# EAGLE design main (EAGLE 4.15)
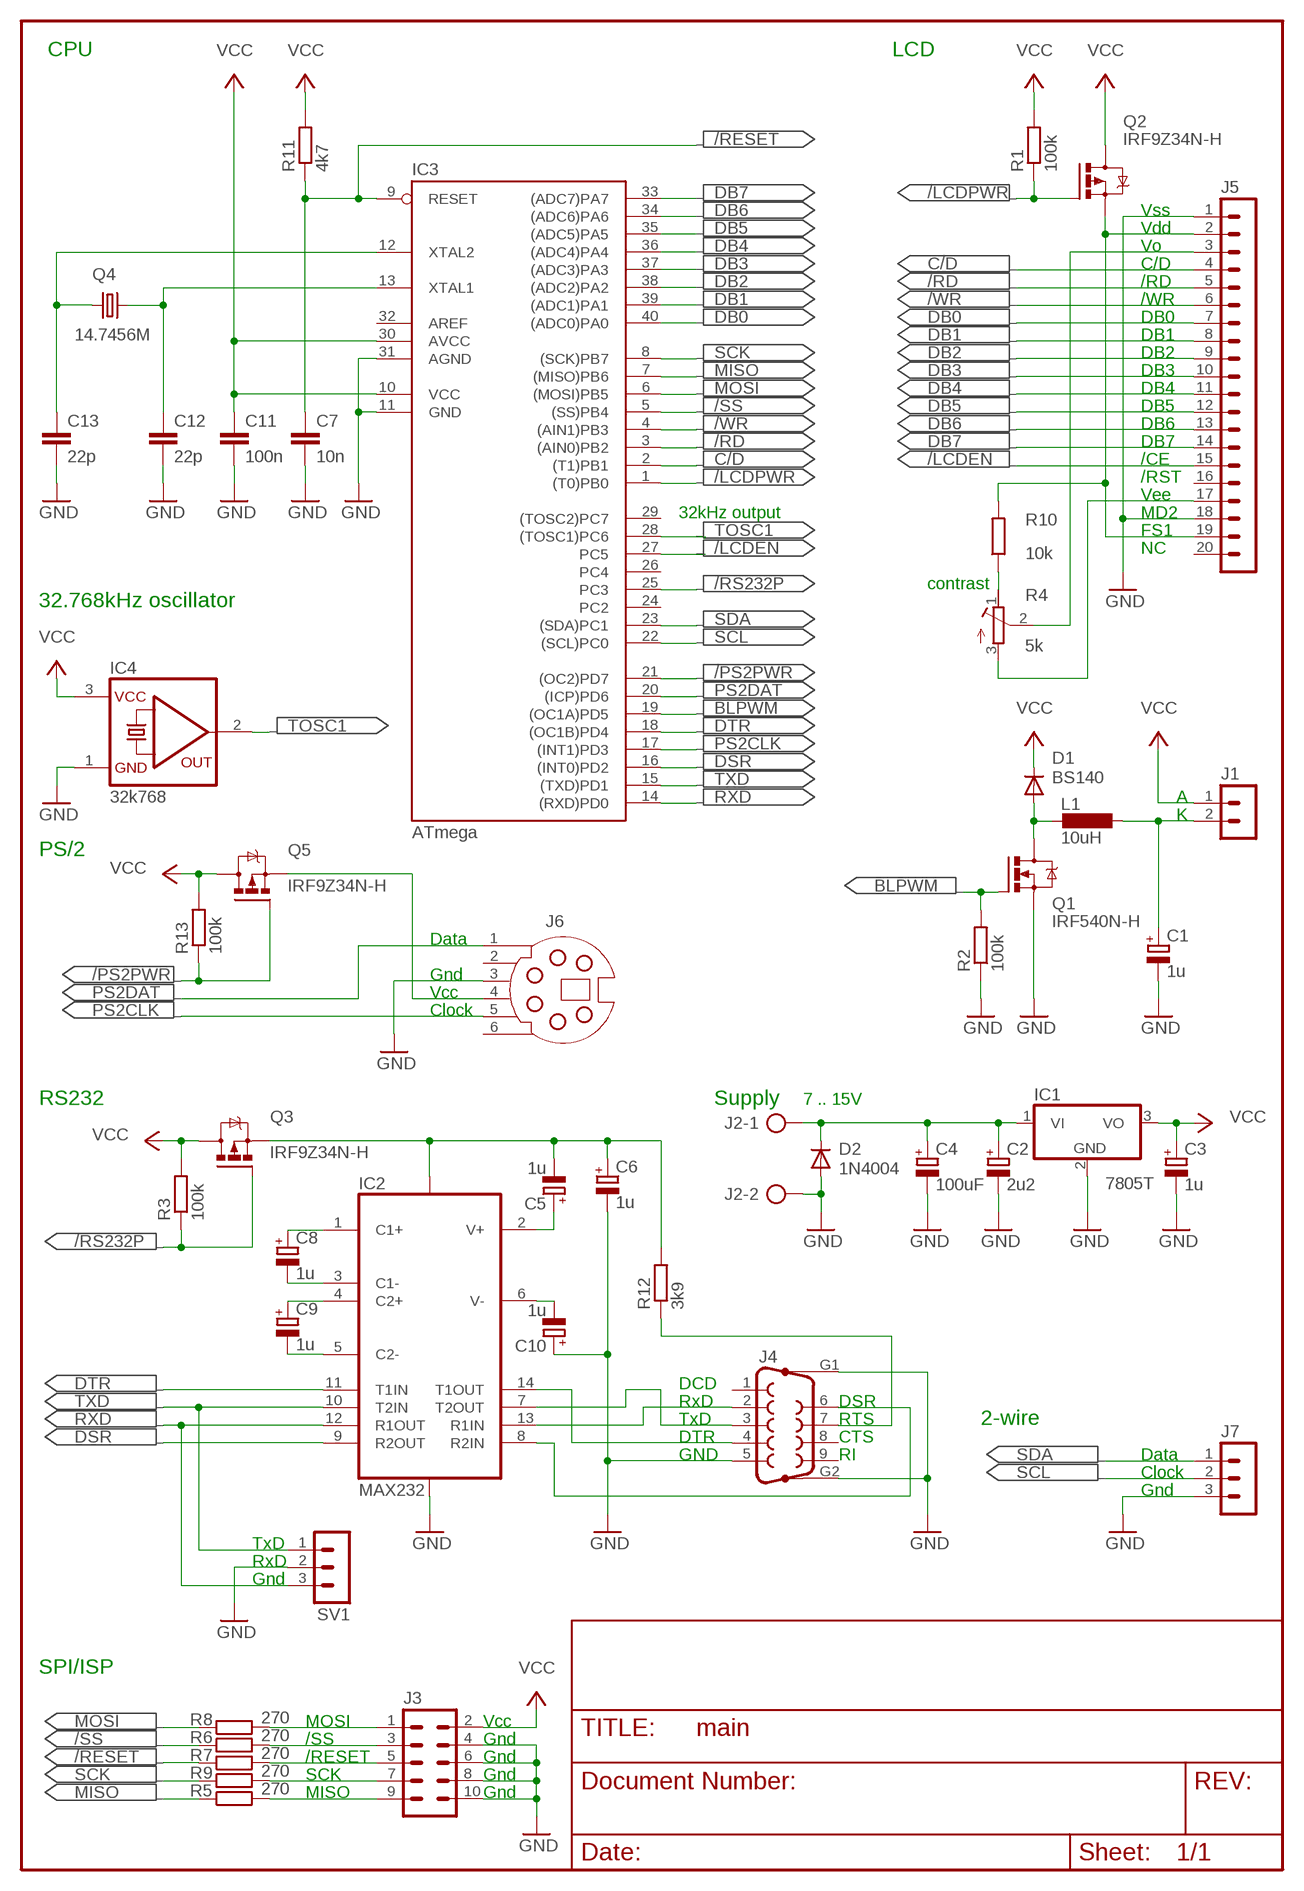
[diagram p0: schematic, sheet 1]

## Parts
C1  1u  CPOL-EUE2-5  [E2-5]
C2  2u2  CPOL-EUE2-5  [E2-5]
C3  1u  CPOL-EUE2-5  [E2-5]
C4  100uF  CPOL-EUE5-8.5  [E5-8,5]
C5  1u  CPOL-EUE2-5  [E2-5]
C6  1u  CPOL-EUE2-5  [E2-5]
C7  10n  C-EU050-025X075  [C050-025X075]
C8  1u  CPOL-EUE2-5  [E2-5]
C9  1u  CPOL-EUE2-5  [E2-5]
C10  1u  CPOL-EUE2-5  [E2-5]
C11  100n  C-EU050-025X075  [C050-025X075]
C12  22p  C-EU025-024X044  [C025-024X044]
C13  22p  C-EU025-024X044  [C025-024X044]
D1  BS140  1N4004  [DO41-10]
D2  1N4004  [DO41-10]
IC1  7805T  [TO220H]
IC2  MAX232  [DIL16]
IC3  ATmega  MEGA163P  [DIL40]
IC4  32k768  SG-10  [SIP3]
J1  MA02-1  [MA02-1]
J2  AK500/2  [AK500/2]
J3  ML10  [ML10]
J4  F09HP  [F09HP]
J5  MA20-1  [MA20-1]
J6  SSV-G06  [SSV-BC06]
J7  MA03-1  [MA03-1]
L1  10uH  L-EU0207/12  [0207/12]
Q1  IRF540N-H  [TO220AB-H]
Q2  IRF9Z34N-H  [TO220AB-H]
Q3  IRF9Z34N-H  [TO220AB-H]
Q4  14.7456M  CRYTALHC18U-H  [HC18U-H]
Q5  IRF9Z34N-H  [TO220AB-H]
R1  100k  R-EU_0207/12  [0207/12]
R2  100k  R-EU_0207/12  [0207/12]
R3  100k  R-EU_0207/12  [0207/12]
R4  5k  R-TRIMM43P  [RTRIM43P]
R5  270  R-EU_0207/12  [0207/12]
R6  270  R-EU_0207/12  [0207/12]
R7  270  R-EU_0207/12  [0207/12]
R8  270  R-EU_0207/12  [0207/12]
R9  270  R-EU_0207/12  [0207/12]
R10  10k  R-EU_0207/12  [0207/12]
R11  4k7  R-EU_0207/12  [0207/12]
R12  3k9  R-EU_0207/12  [0207/12]
R13  100k  R-EU_0207/12  [0207/12]
SV1  MA03-1  [MA03-1]

## Nets
/LCDEN: IC3.27(PC5) J5.15
/LCDPWR: IC3.1((T0)PB0) Q2.1(G) R1.1
/PS2PWR: IC3.21((OC2)PD7) Q5.1(G) R13.1
/RD: IC3.3((AIN0)PB2) J5.5
/RESET: C7.1 IC3.9(RESET) R7.1 R11.1
/RS232P: IC3.25(PC3) Q3.1(G) R3.1
/SS: IC3.5((SS)PB4) R6.1
/WR: IC3.4((AIN1)PB3) J5.6
BLPWM: IC3.19((OC1A)PD5) Q1.1(G) R2.2
C/D: IC3.2((T1)PB1) J5.4
DB0: IC3.40((ADC0)PA0) J5.7
DB1: IC3.39((ADC1)PA1) J5.8
DB2: IC3.38((ADC2)PA2) J5.9
DB3: IC3.37((ADC3)PA3) J5.10
DB4: IC3.36((ADC4)PA4) J5.11
DB5: IC3.35((ADC5)PA5) J5.12
DB6: IC3.34((ADC6)PA6) J5.13
DB7: IC3.33((ADC7)PA7) J5.14
DCD: C5.+ IC2.2(V+)
DSR: IC2.9(R2OUT) IC3.16((INT0)PD2)
DTR: IC2.11(T1IN) IC3.18((OC1B)PD4)
FS1: J5.2 J5.19 Q2.3(S) R10.2
GND: C1.- C2.- C3.- C4.- C6.- C7.2 C10.+ C11.2 C12.2 C13.2 D2.A IC1.2(GND) IC2.15(GND) IC3.11(GND) IC3.31(AGND) IC4.1(GND) J2.2 J3.4 J3.6 J3.8 J3.10 J4.5 J4.G1 J4.G2 J5.1 J5.18 J6.3 J7.3 Q1.3(S) R2.1 SV1.2
MISO: IC3.7((MISO)PB6) R5.1
MOSI: IC3.6((MOSI)PB5) R8.1
N$1: C13.1 IC3.12(XTAL2) Q4.1
N$2: IC2.13(R1IN) J4.2
N$3: IC2.7(T2OUT) J4.3
N$4: C12.1 IC3.13(XTAL1) Q4.2
N$5: J4.7 R12.1
N$6: IC2.14(T1OUT) J4.4
N$7: C8.- IC2.3(C1-)
N$8: C8.+ IC2.1(C1+)
N$9: J5.3 R4.2(S)
N$10: D1.A L1.1 Q1.2(D)
N$11: C9.- IC2.5(C2-)
N$12: C9.+ IC2.4(C2+)
N$13: C10.- IC2.6(V-)
N$14: R4.1(A) R10.1
N$15: C5.- C6.+ IC2.16(VCC) Q3.3(S) R12.2
N$16: C1.+ J1.2 L1.2
N$17: C2.+ C4.+ D2.C IC1.1(VI) J2.1
N$18: J6.4 Q5.3(S)
N$25: J3.9 R5.2
N$26: J3.7 R9.2
N$27: J3.5 R7.2
N$28: J3.1 R8.2
N$29: J3.3 R6.2
PS2CLK: IC3.17((INT1)PD3) J6.5
PS2DAT: IC3.20((ICP)PD6) J6.1
RXD: IC2.12(R1OUT) IC3.14((RXD)PD0) SV1.3
SCK: IC3.8((SCK)PB7) R9.1
SCL: IC3.22((SCL)PC0) J7.2
SDA: IC3.23((SDA)PC1) J7.1
T2OUT: IC2.8(R2IN) J4.6
TOSC1: IC3.28((TOSC1)PC6) IC4.2(OUT)
TXD: IC2.10(T2IN) IC3.15((TXD)PD1) SV1.1
VCC: C3.+ C11.1 D1.C IC1.3(VO) IC3.10(VCC) IC3.30(AVCC) IC4.3(VCC) J1.1 J3.2 Q2.2(D) Q3.2(D) Q5.2(D) R1.2 R3.2 R11.2 R13.2
VEE: J5.17 R4.3(E)
Unconnected: IC3.24(PC2) IC3.26(PC4) IC3.29((TOSC2)PC7) IC3.32(AREF) J4.1 J4.8 J4.9 J5.16 J5.20 J6.2 J6.6

## Notes on the sheet
- CPU | LCD
- Vss
- Vdd
- Vo
- C/D
- /RD
- /WR
- DB0
- DB1
- DB2
- DB3
- DB4
- DB5
- DB6
- DB7
- /CE
- /RST
- Vee
- 32kHz output | MD2
- FS1
- NC
- contrast
- 32.768kHz oscillator
- A
- K
- PS/2
- Data
- Gnd
- Vcc
- Clock
- RS232 | Supply | 7 .. 15V
- DCD
- RxD | DSR
- TxD | RTS | 2-wire
- DTR | CTS
- GND | RI | Data
- Clock
- Gnd
- TxD
- RxD
- Gnd
- SPI/ISP
- MOSI | Vcc
- /SS | Gnd
- /RESET | Gnd
- SCK | Gnd
- MISO | Gnd

## Library data of the parts
C1-C6 C8-C10 = tccn:CPOL-EU: POLARIZED CAPACITOR, European symbol
C7 C11-C13 = tccn:C-EU: CAPACITOR, European symbol
D1 D2 = tccn:1N4004: DIODE general purpose rectifier, 1 A
IC1 = tccn:78*: Positive VOLTAGE REGULATOR Source: http://cache.national.com/ds/LM/LM78L05.pdf http://www.fairchildsemi.com/ds/LM/LM7805.pdf
IC2 = tccn:MAX232: RS232 TRANSEIVER
IC3 = tccn:MEGA163*P: MICROCONTROLLER 16 Kbytes FLASH, 1 Kbytes EEPROM 1 Kbytes SRAM UART 8-channel 10 bit ADC hardware multiplier
IC4 = tccn:SG-10
J1 = tccn:MA02-1: PIN HEADER
J2 = tccn:AK500/2: CONNECTOR
J3 = tccn:ML10: HARTING
J4 = tccn:F09HP: SUB-D
J5 = tccn:MA20-1: PIN HEADER
J6 = tccn:SSV-G06: YAMAICHI CONNECTOR
J7 SV1 = tccn:MA03-1: PIN HEADER
L1 = tccn:L-EU: INDUCTOR, European symbol
Q1 = tccn:IRF540N: N-channel power MOSFET
Q2 Q3 Q5 = tccn:IRF9Z34N: P channel power MOSFET
Q4 = tccn:CRYTAL: CRYSTAL
R1-R3 R5-R13 = tccn:R-EU_: RESISTOR, European symbol
R4 = tccn:R-TRIMM: Trimm resistor

## Board
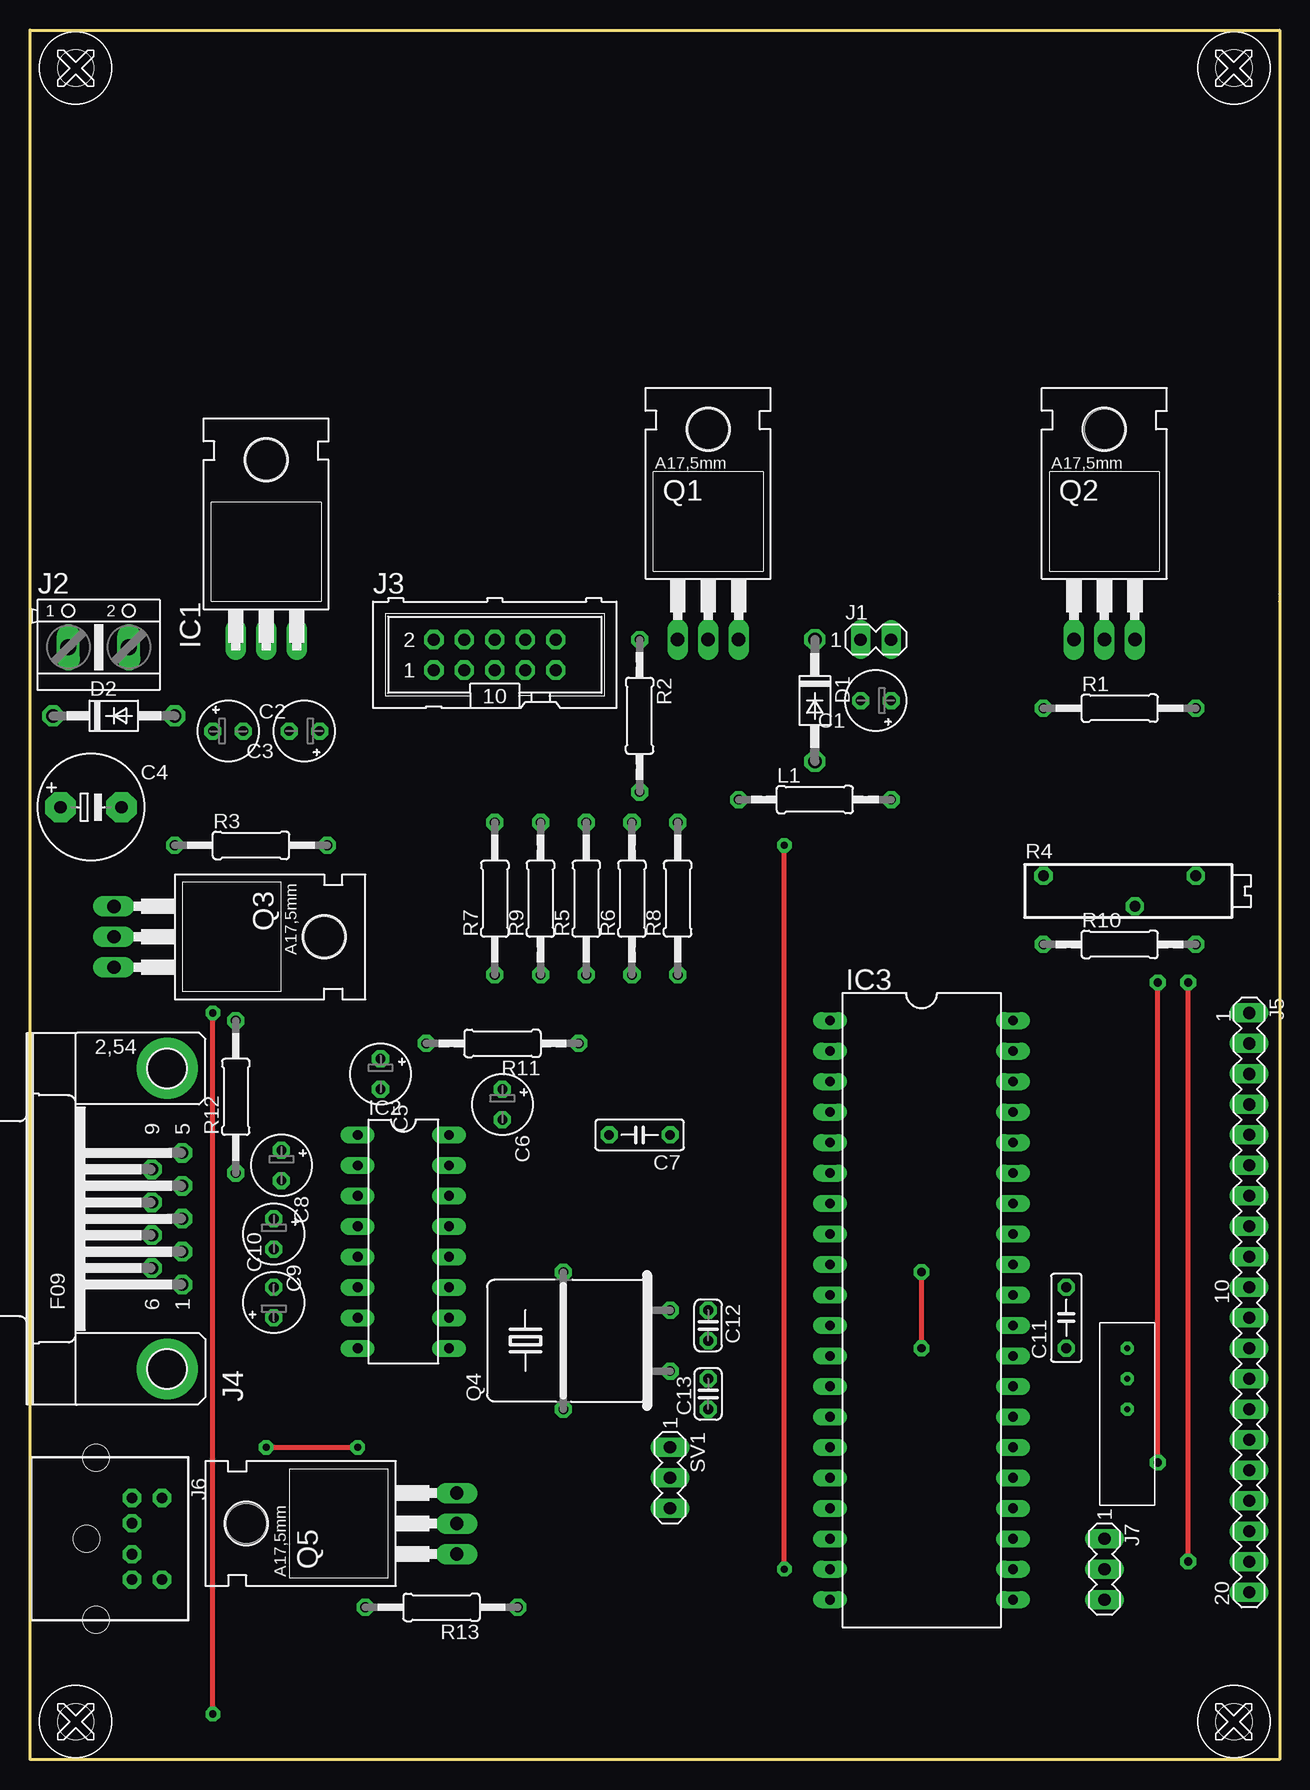
[diagram p1: board, top side]
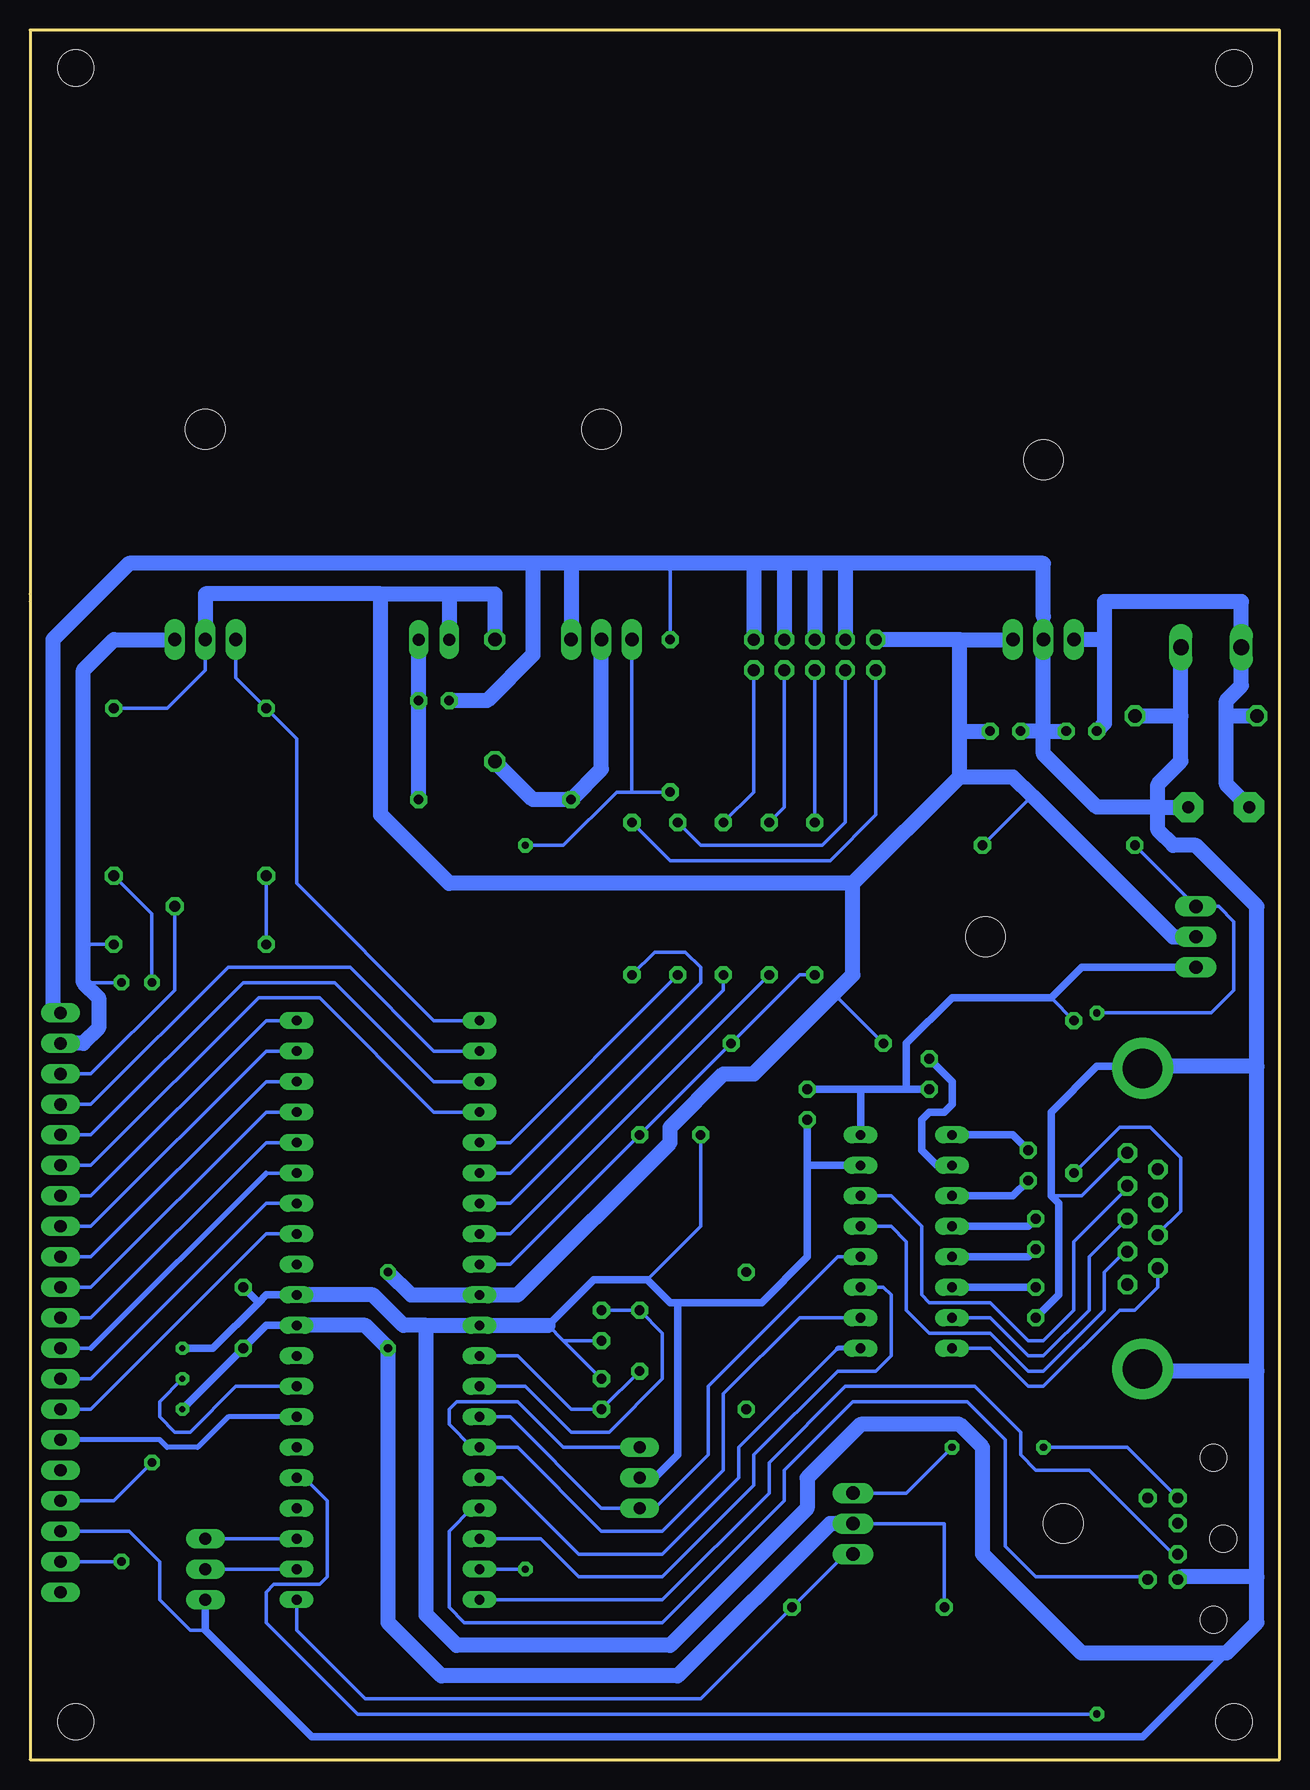
[diagram p2: board, bottom side, seen from below]

Size 104.14 x 144.14 mm. Coordinates in mm from the lower left corner, seen from the top.
Outline: 104.14,97.16 104.14,96.52
Outline: 104.14,96.52 104.14,0 0,0 0,144.14 104.14,144.14 104.14,96.52
Copper layers (1*16): Top 0.035mm / dielectric 1.5mm / Bottom 0.035mm
Design rules "drc": minimum track width 12mil, minimum drill 12mil, track to track 12mil, track to pad 12mil, pad to pad 12mil, via to via 12mil, smd to smd 12mil, copper to edge 25mil, drill to drill 25mil, minimum pad ring 12mil, minimum via ring 12mil, stop-mask expansion 4mil, vias tented up to drill 0mil, thermal gap 10mil

### Footprints (pad centres in the part's own frame; a part is rotated, then mirrored left to right if it is on the bottom)
E2-5 = drill 0.813 pad 1.27 octagon: + -1.27,0; - 1.27,0
E5-8,5 = drill 1.016 pad 2.54 octagon: + -2.54,0; - 2.54,0
C050-025X075 = drill 0.813 octagon: 1 -2.54,0; 2 2.54,0
C025-024X044 = drill 0.813 octagon: 1 -1.27,0; 2 1.27,0
DO41-10 = drill 1.118 octagon: A 5.08,0; C -5.08,0
TO220H = drill 1.118 long: 1 -2.54,-10.16; 2 0,-10.16; 3 2.54,-10.16 | hole 3.302: 0,4.826
DIL16 = drill 0.813 long: 1 -8.89,-3.81; 2 -6.35,-3.81; 3 -3.81,-3.81; 4 -1.27,-3.81; 5 1.27,-3.81; 6 3.81,-3.81; 7 6.35,-3.81; 8 8.89,-3.81; 9 8.89,3.81; 10 6.35,3.81; 11 3.81,3.81; 12 1.27,3.81; 13 -1.27,3.81; 14 -3.81,3.81; 15 -6.35,3.81; 16 -8.89,3.81
DIL40 = drill 0.813 long: 1 -24.13,-7.62; 2 -21.59,-7.62; 3 -19.05,-7.62; 4 -16.51,-7.62; 5 -13.97,-7.62; 6 -11.43,-7.62; 7 -8.89,-7.62; 8 -6.35,-7.62; 9 -3.81,-7.62; 10 -1.27,-7.62; 11 1.27,-7.62; 12 3.81,-7.62; 13 6.35,-7.62; 14 8.89,-7.62; 15 11.43,-7.62; 16 13.97,-7.62; 17 16.51,-7.62; 18 19.05,-7.62; 19 21.59,-7.62; 20 24.13,-7.62; 21 24.13,7.62; 22 21.59,7.62; 23 19.05,7.62; 24 16.51,7.62; 25 13.97,7.62; 26 11.43,7.62; 27 8.89,7.62; 28 6.35,7.62; 29 3.81,7.62; 30 1.27,7.62; 31 -1.27,7.62; 32 -3.81,7.62; 33 -6.35,7.62; 34 -8.89,7.62; 35 -11.43,7.62; 36 -13.97,7.62; 37 -16.51,7.62; 38 -19.05,7.62; 39 -21.59,7.62; 40 -24.13,7.62
SIP3 = drill 0.5 octagon: 1 -5.08,0; 2 -2.54,0; 3 0,0
MA02-1 = drill 1.016 long: 1 -2.54,0; 2 0,0
AK500/2 = drill 1.321 long: 1 -2.515,0; 2 2.515,0
ML10 = drill 1 octagon: 1 -5.08,-1.27; 2 -5.08,1.27; 3 -2.54,-1.27; 4 -2.54,1.27; 5 0,-1.27; 6 0,1.27; 7 2.54,-1.27; 8 2.54,1.27; 9 5.08,-1.27; 10 5.08,1.27
F09HP = drill 1.016 octagon: 1 -5.486,-1.27; 2 -2.743,-1.27; 3 0,-1.27; 4 2.743,-1.27; 5 5.486,-1.27; 6 -4.115,1.27; 7 -1.372,1.27; 8 1.372,1.27; 9 4.115,1.27 | drill 3.302 pad 5.08 round: G1 -12.522,0; G2 12.522,0
MA20-1 = drill 1.016 long: 1 -24.13,0; 2 -21.59,0; 3 -19.05,0; 4 -16.51,0; 5 -13.97,0; 6 -11.43,0; 7 -8.89,0; 8 -6.35,0; 9 -3.81,0; 10 -1.27,0; 11 1.27,0; 12 3.81,0; 13 6.35,0; 14 8.89,0; 15 11.43,0; 16 13.97,0; 17 16.51,0; 18 19.05,0; 19 21.59,0; 20 24.13,0
SSV-BC06 = drill 0.9 octagon: 1 1.3,8.5; 2 -1.3,8.5; 3 3.4,8.5; 4 -3.4,8.5; 5 3.4,11; 6 -3.4,11 | hole 2.2: -6.75,5.5; 0,4.7; 6.75,5.5
MA03-1 = drill 1.016 long: 1 -2.54,0; 2 0,0; 3 2.54,0
0207/12 = drill 0.813 octagon: 1 -6.35,0; 2 6.35,0
TO220AB-H = drill 1.118 long: 1 -2.54,-6.35; 2 0,-6.35; 3 2.54,-6.35 | hole 3.302: 0,11.176
HC18U-H = drill 0.813 octagon: 1 -2.54,-5.08; 2 2.54,-5.08; M -5.715,3.81; M1 5.715,3.81
RTRIM43P = drill 0.9 octagon: 1 -7.62,1.27; 2 0,-1.27; 3 5.08,1.27
3M-SCREW = hole 3: 0,0

### Placement (x,y rotation side)
C1  70.48,88.27 180 top
C2  16.51,85.73 0 top
C3  22.86,85.73 180 top
C4  5.08,79.38 0 top
C5  29.21,57.15 270 top
C6  39.37,54.61 270 top
C7  50.8,52.07 180 top
C8  20.96,49.53 270 top
C9  20.32,43.81 270 top
C10  20.32,38.1 90 top
C11  86.36,36.83 90 top
C12  56.52,36.2 270 top
C13  56.52,30.48 90 top
D1  65.41,88.27 270 top
D2  6.98,87 0 top
IC1  19.69,103.51 0 top
IC2  31.12,43.18 270 top
IC3  74.3,37.47 270 top
IC4  91.44,29.21 270 top
J1  71.76,93.34 0 top
J2  5.71,92.71 0 top
J3  38.73,92.08 0 top
J4  11.43,45.08 90 top
J5  101.6,38.1 270 top
J6  0,18.41 270 top
J7  89.54,15.88 270 top
L1  65.41,80.01 0 top
Q1  56.52,99.7 0 top
Q2  89.54,99.7 0 top
Q3  13.33,68.58 270 top
Q4  48.26,34.92 90 top
Q5  29.21,19.68 90 top
R1  90.81,87.63 0 top
R2  50.8,87 270 top
R3  18.42,76.2 0 top
R4  92.08,72.39 0 top
R5  46.35,71.76 90 top
R6  50.16,71.76 90 top
R7  38.73,71.75 90 top
R8  53.98,71.75 90 top
R9  42.54,71.75 90 top
R10  90.81,67.94 0 top
R11  39.37,59.69 180 top
R12  17.15,55.25 90 top
R13  34.29,12.7 180 top
SV1  53.34,23.49 270 top
U$1  [3M-SCREW]  3.81,140.97 0 top
U$2  [3M-SCREW]  100.33,140.97 0 top
U$3  [3M-SCREW]  3.81,3.17 0 top
U$4  [3M-SCREW]  100.33,3.17 0 top

### Tracks (layer width: path | path; a pad name or v marks a point on that pad's centre or on a via)
/LCDEN
  Bottom 0.406: IC3.27 87.63,28.57 90.17,26.04 92.71,26.04 93.34,26.67 101.44,26.67 101.6,26.51 J5.15
/LCDPWR
  Bottom 0.305: IC3.1 70.48,61.59 81.92,73.03 81.92,85.09 R1.1 87,90.17 Q2.1
/PS2PWR
  Bottom 0.305: Q5.1 36.2,17.14 R13.1 48.26,5.08 76.2,5.08 81.92,10.79 IC3.21
/RD
  Bottom 0.305: J5.5 99.06,52.07 86.36,64.77 78.74,64.77 70.48,56.52 IC3.3
/RESET
  Bottom 0.305: IC3.9 64.14,41.27 C7.1 R11.1 40,65.41 R7.1
/RS232P  (via drill 0.6)
  Top 0.406: v15.24,3.81 v15.24,62.23
  Bottom 0.305: R3.1 Q3.1 5.08,71.12 3.81,69.85 3.81,64.14 5.71,62.23 v15.24,62.23 | IC3.25 81.28,23.49 79.38,21.59 79.38,15.24 80.01,14.6 83.82,14.6 84.45,13.97 84.45,11.43 76.84,3.81 v15.24,3.81
/SS
  Bottom 0.305: R6.1 64.14,51.44 IC3.5
/WR
  Bottom 0.305: J5.6 99.06,49.53 85.09,63.5 80.01,63.5 70.48,53.97 IC3.4
BLPWM  (via drill 0.6)
  Top 0.406: v62.86,15.88 v62.86,76.2
  Bottom 0.305: 53.98,80.64 Q1.1 | 53.98,80.64 R2.2 | v62.86,15.88 IC3.19 | v62.86,76.2 59.69,76.2 55.24,80.64 53.98,80.64
C/D
  Bottom 0.305: J5.4 99.06,54.61 87.63,66.04 77.47,66.04 70.48,59.05 IC3.2
DB0
  Bottom 0.305: IC3.40 84.45,61.59 99.06,46.99 J5.7
DB1
  Bottom 0.305: IC3.39 84.45,59.05 99.06,44.45 J5.8
DB2
  Bottom 0.305: IC3.38 84.45,56.52 99.06,41.91 J5.9
DB3
  Bottom 0.305: IC3.37 84.45,53.97 99.06,39.37 J5.10
DB4
  Bottom 0.305: IC3.36 84.45,51.44 99.06,36.83 J5.11
DB5
  Bottom 0.305: IC3.35 84.45,48.89 | 99.06,34.29 J5.12
  Bottom 0.406: 84.45,48.89 99.06,34.29
DB6
  Bottom 0.305: IC3.34 84.45,46.36 99.06,31.75 J5.13
DB7
  Bottom 0.305: IC3.33 84.45,43.81 99.06,29.21 J5.14
DCD
  Bottom 0.61: IC2.2 28.58,49.53 29.85,50.8 29.85,53.34 29.21,53.97 27.94,53.97 27.31,54.61 27.31,56.52 C5.+
DSR
  Bottom 0.305: IC3.16 64.77,23.49 58.42,17.14 51.43,17.14 45.09,23.49 45.09,26.04 36.83,34.29
  Bottom 0.406: IC2.9 36.83,34.29
DTR
  Bottom 0.305: IC3.18 61.59,18.41 58.42,15.24 51.43,15.24 43.81,22.86 43.81,25.4 36.83,32.38 33.66,32.38 32.38,33.66 32.38,38.73 33.02,39.37 IC2.11
FS1  (via drill 0.7)
  Top 0.406: v96.52,16.51 v96.52,64.77
  Bottom 0.305: 99.7,67.94 R10.2 | v96.52,16.51 J5.19 | v96.52,64.77 99.7,64.77
  Bottom 1.27: Q2.3 97.16,93.34 99.7,90.81 99.7,67.94 99.7,64.77 98.43,63.5 98.43,60.96 99.7,59.69 J5.2
GND
  Bottom 0.305: 19.69,94.62 19.69,95.25 | 19.05,46.99 16.51,46.99 12.7,50.8 J4.5 | 89.54,10.79 90.81,10.79 93.34,13.33 93.34,16.51 95.89,19.05 J5.18 | 59.69,34.92 C12.2 | 59.69,34.92 C13.2 | 60.96,36.2 59.69,34.92 | C7.2 48.26,44.45 52.7,40 | 50.8,99.7 R2.1 | 8.26,15.24 8.48,15.01
  Bottom 0.61: 39.37,49.53 IC2.15 | 39.37,49.53 C6.- | 39.37,49.53 39.37,41.91 43.18,38.1 50.16,38.1 | SV1.2 52.07,23.49 50.16,25.4 50.16,38.1 | C10.+ 18.42,38.73 18.42,46.36 19.05,46.99 19.05,53.97 15.24,57.78 11.43,57.78 J4.G2 | J7.3 89.54,10.79 80.65,1.9 11.43,1.9 4.45,8.89 | 85.09,38.1 C11.2 | IC3.31 84.45,38.73 85.09,38.1 | IC4.1 88.9,34.29 85.09,38.1 | 60.96,36.2 57.15,40 52.7,40 50.8,38.1 50.16,38.1 | 11.43,32.38 J4.G1
  Bottom 1.27: 19.69,85.73 C2.- | 19.69,85.73 C3.- | 19.69,85.73 IC1.2 19.69,94.62 | C1.- 66.04,88.27 62.23,92.08 62.23,99.7 | 59.05,99.7 62.23,99.7 | 62.23,99.7 95.89,99.7 102.23,93.34 102.23,62.86 J5.1 | 59.05,99.7 Q1.3 | 43.81,99.7 50.8,99.7 59.05,99.7 | 19.69,95.25 19.69,99.7 36.2,99.7 | 36.2,99.7 J3.4 | 10.16,79.38 15.24,79.38 19.69,83.82 19.69,85.73 | 10.16,79.38 10.16,77.47 8.89,76.2 6.98,76.2 1.91,71.12 1.91,57.78 | 38.73,99.7 J3.6 | 36.2,99.7 38.73,99.7 | 41.27,99.7 J3.8 | 38.73,99.7 41.27,99.7 | 43.81,99.7 J3.10 | 41.27,99.7 43.81,99.7 | 8.23,86.97 J2.2 | 10.16,79.38 10.16,81.28 8.23,83.21 8.23,86.97 | 10.16,79.38 C4.- | 8.23,86.97 12.04,86.97 D2.A | 71.12,36.2 IC3.11 60.96,36.2 | 71.12,36.2 73.03,36.2 75.57,38.73 IC3.31 | 1.91,15.24 1.91,32.38 | 1.91,32.38 1.91,57.78 | 1.91,57.78 11.43,57.78 | 1.91,32.38 11.43,32.38 | 8.48,15.01 J6.3 | 1.91,15.24 8.26,15.24 | 1.91,15.24 1.91,11.43 4.45,8.89 16.51,8.89 24.77,17.14 24.77,26.04 26.67,27.94 34.92,27.94 39.37,23.49 39.37,20.95 50.8,9.52 68.58,9.52 71.12,12.06 71.12,36.2
MISO
  Bottom 0.305: R5.1 46.35,64.14 64.14,46.36 IC3.7
MOSI
  Bottom 0.305: R8.1 52.07,67.31 49.53,67.31 48.26,66.04 48.26,64.77 64.14,48.89 IC3.6
N$1
  Bottom 0.305: Q4.1 C13.1 59.05,29.21 63.5,33.66 IC3.12
N$2
  Bottom 0.305: IC2.13 32.38,44.45 31.12,43.18 31.12,37.47 29.21,35.56 24.13,35.56 20.96,32.38 19.69,32.38 14.61,37.47 14.61,40.64 12.7,42.55 J4.2
N$3
  Bottom 0.305: IC2.7 24.13,36.83 20.96,33.66 19.69,33.66 15.88,37.47 15.88,41.91 J4.3
N$4
  Bottom 0.305: C12.1 Q4.2 51.43,35.56 51.43,31.75 55.88,27.3 59.05,27.3 62.86,31.11 IC3.13
N$5
  Bottom 0.305: J4.7 10.16,43.81 8.26,45.72 8.26,50.17 10.79,52.7 13.33,52.7 R12.1
N$6
  Bottom 0.305: IC2.14 32.38,46.99 29.85,44.45 29.85,38.73 29.21,38.1 24.13,38.1 20.96,34.92 19.69,34.92 17.15,37.47 17.15,43.18 12.7,47.62 J4.4
N$7
  Bottom 0.61: C8.- 22.23,46.99 IC2.3
N$8
  Bottom 0.61: C8.+ 22.23,52.07 IC2.1
N$9
  Bottom 0.305: R4.2 92.08,64.14 99.06,57.15 J5.3
N$10
  Bottom 1.27: D1.A 62.23,80.01 L1.1 56.52,82.55 Q1.2
N$11
  Bottom 0.61: C9.- 20.96,41.91 IC2.5
N$12
  Bottom 0.61: C9.+ 20.96,44.45 IC2.4
N$13
  Bottom 0.61: C10.- IC2.6
N$14
  Bottom 0.305: R10.1 R4.1
N$15
  Bottom 0.305: 19.05,63.5 R12.2
  Bottom 0.61: 34.92,55.88 C6.+ | 31.12,55.88 C5.- | 31.12,55.88 34.92,55.88 | 34.92,55.88 IC2.16 | Q3.3 16.51,66.04 19.05,63.5 27.31,63.5 31.12,59.69 31.12,55.88
N$16
  Bottom 1.27: L1.2 C1.+ J1.2
N$17
  Bottom 1.27: 14.61,93.34 14.61,86.36 C2.+ | 14.61,93.34 14.61,96.52 3.17,96.52 3.2,96.5 J2.1 3.2,89.51 4.45,88.27 4.45,87 | 14.61,93.34 IC1.1 | 4.45,87 D2.C | C4.+ 4.45,81.28 4.45,87
N$18  (via drill 0.6)
  Top 0.406: v19.69,26.04 v27.31,26.04
  Bottom 0.305: v27.31,26.04 31.12,22.23 Q5.3 | 8.48,21.81 8.26,21.59 | J6.4 8.48,21.81 | v19.69,26.04 12.7,26.04 8.48,21.81
N$25
  Bottom 0.305: R5.2 43.81,80.64 J3.9
N$26
  Bottom 0.305: R9.2 | J3.7 41.27,79.38 R9.2
N$27
  Bottom 0.305: R7.2 J3.5
N$28
  Bottom 0.305: R8.2 50.8,74.93 37.46,74.93 33.66,78.74 J3.1
N$29
  Bottom 0.305: J3.3 36.2,78.11 38.1,76.2 48.26,76.2 R6.2 | R6.2
PS2CLK
  Bottom 0.305: IC3.17 67.31,20.95 69.22,19.05 69.22,12.7 67.95,11.43 51.43,11.43 41.27,21.59 41.27,24.13 35.56,29.84 26.04,29.84 22.86,26.67 22.86,17.78 20.32,15.24 10.79,15.24 11,15.04 J6.5
PS2DAT
  Bottom 0.305: IC3.20 51.43,13.33 42.54,22.23 42.54,24.77 36.2,31.11 25.4,31.11 21.59,27.3 21.59,25.4 20.32,24.13 15.88,24.13 8.89,17.14 8.26,17.14 | J6.1 8.29,17.11
  Bottom 0.61: 8.29,17.11 8.26,17.14
RXD
  Bottom 0.305: IC3.14 64.14,28.57 56.52,20.95 SV1.3 52.07,20.95 47.62,25.4 47.62,31.11 36.83,41.91 IC2.12
SCK
  Bottom 0.305: IC3.8 64.14,43.81 R9.1 | R9.1
SCL
  Bottom 0.305: IC3.22 J7.2
SDA
  Bottom 0.305: IC3.23 J7.1
T2OUT
  Bottom 0.305: IC2.8 24.13,34.29 20.96,31.11 19.69,31.11 13.33,37.47 12.06,37.47 10.16,39.37 J4.6
TOSC1
  Bottom 0.305: IC4.2 93.34,29.84 93.34,28.57 92.08,27.3 90.81,27.3 87,31.11 IC3.28
TXD
  Bottom 0.305: IC2.10 40,36.83 46.35,30.48 46.35,24.13 51.43,19.05 56.52,19.05 63.5,26.04 IC3.15 67.31,26.04 69.22,27.94 69.22,29.21 68.58,29.84 63.5,29.84 59.69,26.04 SV1.1
VCC  (via drill 0.7)
  Top 0.406: v74.3,34.29 v74.3,40.64
  Bottom 0.305: R1.2 92.71,87.63 89.54,90.81 Q2.2 | 20.64,80.33 R3.2 | 37.46,64.14 37.15,63.82 R11.2 | R13.2 27.94,19.68 Q5.2
  Bottom 0.61: IC3.30 84.45,36.2 C11.1 IC4.3
  Bottom 1.27: 26.67,81.92 26.67,85.73 | 26.67,85.73 26.67,93.34 | 26.67,93.34 IC1.3 | 26.67,93.34 J3.2 | Q3.2 8.89,68.58 20.64,80.33 22.23,81.92 26.67,81.92 | 35.56,73.03 26.67,81.92 | 35.56,73.03 35.56,65.41 37.15,63.82 43.81,57.15 46.35,57.15 50.8,52.7 50.8,51.44 63.5,38.73 IC3.10 72.39,38.73 v74.3,40.64 | IC3.30 76.2,36.2 v74.3,34.29 74.3,11.43 69.85,6.98 50.16,6.98 37.46,19.68 Q5.2 | 26.67,85.73 C3.+ | Q2.2 89.54,97.16 74.93,97.16 | 74.93,97.16 69.22,97.16 | 35.56,73.03 69.22,73.03 74.93,78.74 74.93,97.16 | 69.22,97.16 J1.1 | 69.22,97.16 65.41,97.16 D1.C
VEE  (via drill 0.7)
  Top 0.406: v93.98,24.77 v93.98,64.77
  Bottom 0.305: R4.3 93.98,70.48 v93.98,64.77 | J5.17 97.16,21.59 v93.98,24.77